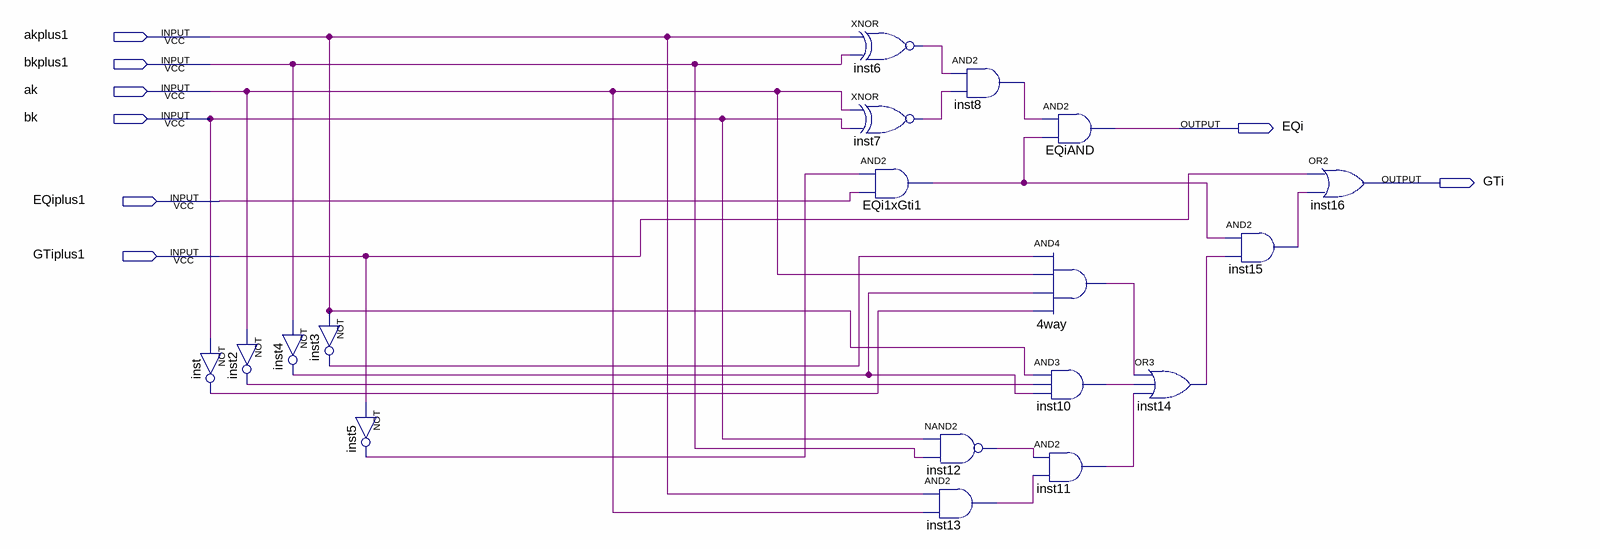
[diagram p0: schematic sheet]
// Quartus schematic twoBitComparator.bdf as structural Verilog: 18 symbols, 8 pins
module twoBitComparator (
  input  akplus1,
  input  bkplus1,
  input  ak,
  input  bk,
  input  EQiplus1,
  input  GTiplus1,
  output EQi,
  output GTi
);

  wire EQi1xGti1_out, inst2_out, inst3_out, inst4_out, inst5_out, inst6_out, inst7_out, inst8_out,
       inst10_out, inst11_out, inst12_out, inst13_out, inst14_out, inst15_out, inst_out, n4way_out;

  not inst (inst_out, bk);
  not inst4 (inst4_out, bkplus1);
  not inst2 (inst2_out, ak);
  not inst3 (inst3_out, akplus1);
  not inst5 (inst5_out, GTiplus1);
  xnor inst6 (inst6_out, akplus1, bkplus1);
  xnor inst7 (inst7_out, ak, bk);
  and EQi1xGti1 (EQi1xGti1_out, inst5_out, EQiplus1);
  nand inst12 (inst12_out, bk, bkplus1);
  and inst13 (inst13_out, akplus1, ak);
  and inst8 (inst8_out, inst6_out, inst7_out);
  and EQiAND (EQi, inst8_out, EQi1xGti1_out);
  and u_4way (n4way_out, inst3_out, ak, inst4_out, inst_out);
  and inst10 (inst10_out, akplus1, inst2_out, inst4_out);
  and inst11 (inst11_out, inst12_out, inst13_out);
  or inst14 (inst14_out, n4way_out, inst10_out, inst11_out);
  and inst15 (inst15_out, EQi1xGti1_out, inst14_out);
  or inst16 (GTi, GTiplus1, inst15_out);
endmodule
